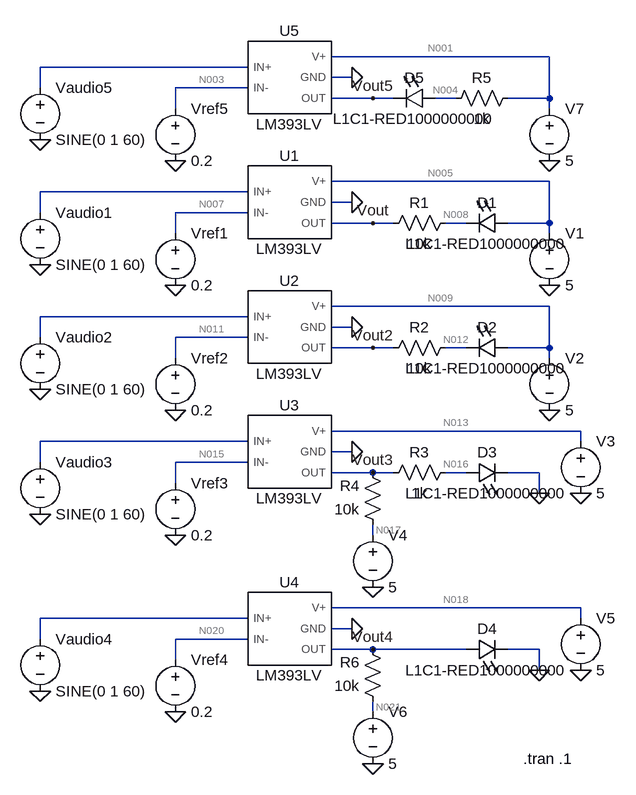
[diagram p0: schematic Draft3.asc]
Draft3.asc, the LTspice schematic file:
Version 4
SHEET 1 880 1044
WIRE 608 -64 272 -64
WIRE 144 -48 -176 -48
WIRE 304 -32 272 -32
WIRE -176 -16 -176 -48
WIRE 144 -16 32 -16
WIRE 336 0 272 0
WIRE 368 0 336 0
WIRE 464 0 432 0
WIRE 608 0 608 -64
WIRE 608 0 544 0
WIRE 32 16 32 -16
WIRE 608 16 608 0
WIRE 608 128 272 128
WIRE 144 144 -176 144
WIRE 304 160 272 160
WIRE -176 176 -176 144
WIRE 144 176 32 176
WIRE 336 192 272 192
WIRE 368 192 336 192
WIRE 480 192 448 192
WIRE 608 192 608 128
WIRE 608 192 544 192
WIRE 32 208 32 176
WIRE 608 208 608 192
WIRE 608 320 272 320
WIRE 144 336 -176 336
WIRE 304 352 272 352
WIRE -176 368 -176 336
WIRE 144 368 32 368
WIRE 336 384 272 384
WIRE 368 384 336 384
WIRE 480 384 448 384
WIRE 608 384 608 320
WIRE 608 384 544 384
WIRE 32 400 32 368
WIRE 608 400 608 384
WIRE 656 512 272 512
WIRE 144 528 -176 528
WIRE 656 528 656 512
WIRE 304 544 272 544
WIRE -176 560 -176 528
WIRE 144 560 32 560
WIRE 336 576 272 576
WIRE 368 576 336 576
WIRE 480 576 448 576
WIRE 592 576 544 576
WIRE 32 592 32 560
WIRE 592 608 592 576
WIRE 336 672 336 656
WIRE 656 784 272 784
WIRE 144 800 -176 800
WIRE 656 800 656 784
WIRE 304 816 272 816
WIRE -176 832 -176 800
WIRE 144 832 32 832
WIRE 336 848 272 848
WIRE 480 848 336 848
WIRE 592 848 544 848
WIRE 32 864 32 832
WIRE 592 880 592 848
WIRE 336 944 336 928
FLAG 608 288 0
FLAG 304 160 0
FLAG -176 256 0
FLAG 336 192 Vout
FLAG 608 480 0
FLAG 304 352 0
FLAG 336 384 Vout2
FLAG 656 608 0
FLAG 304 544 0
FLAG 336 576 Vout3
FLAG 592 608 0
FLAG 336 752 0
FLAG 656 880 0
FLAG 304 816 0
FLAG 336 848 Vout4
FLAG 592 880 0
FLAG 336 1024 0
FLAG -176 448 0
FLAG -176 640 0
FLAG -176 912 0
FLAG 32 288 0
FLAG 32 480 0
FLAG 32 672 0
FLAG 32 944 0
FLAG 608 96 0
FLAG 304 -32 0
FLAG 336 0 Vout5
FLAG -176 64 0
FLAG 32 96 0
SYMBOL LM393LV 208 160 R0
SYMATTR InstName U1
SYMBOL res 464 176 R90
WINDOW 0 0 56 VBottom 2
WINDOW 3 32 56 VTop 2
SYMATTR InstName R1
SYMATTR Value 10k
SYMBOL voltage 608 192 R0
SYMATTR InstName V1
SYMATTR Value 5
SYMBOL voltage -176 160 R0
WINDOW 123 0 0 Left 0
WINDOW 39 0 0 Left 0
SYMATTR InstName Vaudio1
SYMATTR Value SINE(0 1 60)
SYMBOL LM393LV 208 352 R0
SYMATTR InstName U2
SYMBOL res 464 368 R90
WINDOW 0 0 56 VBottom 2
WINDOW 3 32 56 VTop 2
SYMATTR InstName R2
SYMATTR Value 10k
SYMBOL voltage 608 384 R0
SYMATTR InstName V2
SYMATTR Value 5
SYMBOL LM393LV 208 544 R0
SYMATTR InstName U3
SYMBOL res 352 592 R270
WINDOW 0 32 56 VTop 2
WINDOW 3 0 56 VBottom 2
SYMATTR InstName R3
SYMATTR Value 1k
SYMBOL voltage 656 512 R0
SYMATTR InstName V3
SYMATTR Value 5
SYMBOL res 352 672 R180
WINDOW 0 36 76 Left 2
WINDOW 3 36 40 Left 2
SYMATTR InstName R4
SYMATTR Value 10k
SYMBOL voltage 336 656 R0
SYMATTR InstName V4
SYMATTR Value 5
SYMBOL LED 544 176 R90
WINDOW 0 0 32 VBottom 2
WINDOW 3 32 32 VTop 2
SYMATTR InstName D1
SYMATTR Value L1C1-RED1000000000
SYMATTR Description Diode
SYMATTR Type diode
SYMBOL LED 544 368 R90
WINDOW 0 0 32 VBottom 2
WINDOW 3 32 32 VTop 2
SYMATTR InstName D2
SYMATTR Value L1C1-RED1000000000
SYMATTR Description Diode
SYMATTR Type diode
SYMBOL LED 480 592 R270
WINDOW 0 32 32 VTop 2
WINDOW 3 0 32 VBottom 2
SYMATTR InstName D3
SYMATTR Value L1C1-RED1000000000
SYMATTR Description Diode
SYMATTR Type diode
SYMBOL LM393LV 208 816 R0
SYMATTR InstName U4
SYMBOL voltage 656 784 R0
SYMATTR InstName V5
SYMATTR Value 5
SYMBOL res 352 944 R180
WINDOW 0 36 76 Left 2
WINDOW 3 36 40 Left 2
SYMATTR InstName R6
SYMATTR Value 10k
SYMBOL voltage 336 928 R0
SYMATTR InstName V6
SYMATTR Value 5
SYMBOL LED 480 864 R270
WINDOW 0 32 32 VTop 2
WINDOW 3 0 32 VBottom 2
SYMATTR InstName D4
SYMATTR Value L1C1-RED1000000000
SYMATTR Description Diode
SYMATTR Type diode
SYMBOL voltage -176 352 R0
WINDOW 123 0 0 Left 0
WINDOW 39 0 0 Left 0
SYMATTR InstName Vaudio2
SYMATTR Value SINE(0 1 60)
SYMBOL voltage -176 544 R0
WINDOW 123 0 0 Left 0
WINDOW 39 0 0 Left 0
SYMATTR InstName Vaudio3
SYMATTR Value SINE(0 1 60)
SYMBOL voltage -176 816 R0
WINDOW 123 0 0 Left 0
WINDOW 39 0 0 Left 0
SYMATTR InstName Vaudio4
SYMATTR Value SINE(0 1 60)
SYMBOL voltage 32 192 R0
SYMATTR InstName Vref1
SYMATTR Value 0.2
SYMBOL voltage 32 384 R0
SYMATTR InstName Vref2
SYMATTR Value 0.2
SYMBOL voltage 32 576 R0
SYMATTR InstName Vref3
SYMATTR Value 0.2
SYMBOL voltage 32 848 R0
SYMATTR InstName Vref4
SYMATTR Value 0.2
SYMBOL LM393LV 208 -32 R0
SYMATTR InstName U5
SYMBOL res 560 -16 R90
WINDOW 0 0 56 VBottom 2
WINDOW 3 32 56 VTop 2
SYMATTR InstName R5
SYMATTR Value 1k
SYMBOL voltage 608 0 R0
SYMATTR InstName V7
SYMATTR Value 5
SYMBOL LED 432 -16 R90
WINDOW 0 0 32 VBottom 2
WINDOW 3 32 32 VTop 2
SYMATTR InstName D5
SYMATTR Value L1C1-RED1000000000
SYMATTR Description Diode
SYMATTR Type diode
SYMBOL voltage -176 -32 R0
WINDOW 123 0 0 Left 0
WINDOW 39 0 0 Left 0
SYMATTR InstName Vaudio5
SYMATTR Value SINE(0 1 60)
SYMBOL voltage 32 0 R0
SYMATTR InstName Vref5
SYMATTR Value 0.2
TEXT 568 1016 Left 2 !.tran .1

The netlist it stands for:
* Draft3.asc
XU1 N006 N007 N005 0 Vout LM393LV  ; pins IN+ IN- V+ GND OUT
R1 N008 Vout 10k
V1 N005 0 5
Vaudio1 N006 0 SINE(0 1 60)
XU2 N010 N011 N009 0 Vout2 LM393LV  ; pins IN+ IN- V+ GND OUT
R2 N012 Vout2 10k
V2 N009 0 5
XU3 N014 N015 N013 0 Vout3 LM393LV  ; pins IN+ IN- V+ GND OUT
R3 Vout3 N016 1k
V3 N013 0 5
R4 N017 Vout3 10k
V4 N017 0 5
D1 N005 N008 L1C1-RED1000000000
D2 N009 N012 L1C1-RED1000000000
D3 N016 0 L1C1-RED1000000000
XU4 N019 N020 N018 0 Vout4 LM393LV  ; pins IN+ IN- V+ GND OUT
V5 N018 0 5
R6 N021 Vout4 10k
V6 N021 0 5
D4 Vout4 0 L1C1-RED1000000000
Vaudio2 N010 0 SINE(0 1 60)
Vaudio3 N014 0 SINE(0 1 60)
Vaudio4 N019 0 SINE(0 1 60)
Vref1 N007 0 0.2
Vref2 N011 0 0.2
Vref3 N015 0 0.2
Vref4 N020 0 0.2
XU5 N002 N003 N001 0 Vout5 LM393LV  ; pins IN+ IN- V+ GND OUT
R5 N001 N004 1k
V7 N001 0 5
D5 N004 Vout5 L1C1-RED1000000000
Vaudio5 N002 0 SINE(0 1 60)
Vref5 N003 0 0.2
.model D D
.lib standard.dio
.tran .1
.lib C:\Users\alfaw\Documents\LTspice\Spectrum Analyzer\snom697a\lm393lv.lib
.backanno
.end

* Results of the author's LTspice run, read from the files saved beside the schematic
* Operating Point, zero values left out:
*   V(n005) = 5 V
*   V(vout) = 21.96 mV
*   V(n007) = 200 mV
*   V(n008) = 3.564 V
*   V(n009) = 5 V
*   V(vout2) = 21.96 mV
*   V(n011) = 200 mV
*   V(n012) = 3.564 V
*   V(n013) = 5 V
*   V(vout3) = 30.81 mV
*   V(n015) = 200 mV
*   V(n016) = 30.81 mV
*   V(n017) = 5 V
*   V(n018) = 5 V
*   V(vout4) = 30.81 mV
*   V(n020) = 200 mV
*   V(n021) = 5 V
*   V(n001) = 5 V
*   V(vout5) = 202.2 mV
*   V(n003) = 200 mV
*   V(n004) = 1.739 V
*   I(D1) = 354.2 µA
*   I(D2) = 354.2 µA
*   I(D5) = 3.261 mA
*   I(R1) = 354.2 µA
*   I(R2) = 354.2 µA
*   I(R4) = 496.9 µA
*   I(R6) = 496.9 µA
*   I(R5) = 3.261 mA
*   I(V1) = -379.2 µA
*   I(Vaudio1) = -5 pA
*   I(V2) = -379.2 µA
*   I(V3) = -25 µA
*   I(V4) = -496.9 µA
*   I(V5) = -25 µA
*   I(V6) = -496.9 µA
*   I(Vaudio2) = -5 pA
*   I(Vaudio3) = -5 pA
*   I(Vaudio4) = -5 pA
*   I(Vref1) = -5 pA
*   I(Vref2) = -5 pA
*   I(Vref3) = -5 pA
*   I(Vref4) = -5 pA
*   I(V7) = -3.286 mA
*   I(Vaudio5) = -5 pA
*   I(Vref5) = -5 pA
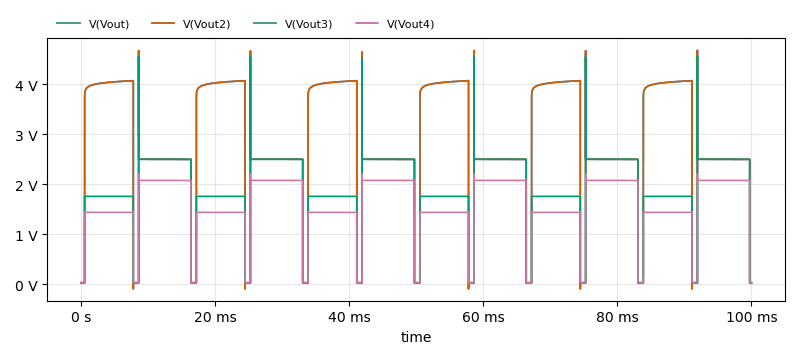
[diagram p1: Transient Analysis of Draft3.asc, plotted from the saved traces]
* Transient Analysis, 1 run:
*   V(Vout): min -92.88 mV, max 4.679 V, average 2.928 V, rms 3.161 V, last 21.96 mV
*   V(Vout2): min -92.88 mV, max 4.679 V, average 2.928 V, rms 3.161 V, last 21.96 mV
*   V(Vout3): min 30.81 mV, max 4.564 V, average 1.939 V, rms 2.066 V, last 30.81 mV
*   V(Vout4): min 30.81 mV, max 2.21 V, average 1.601 V, rms 1.708 V, last 30.81 mV